# EasyEDA schematic Activation_unfinished_easyeda.json
TITLE: Sheet_1; REV: 1.0; Date: 2021-01-14; Sheet: 1/1; Drawn By: roydouek; Company: Your Company
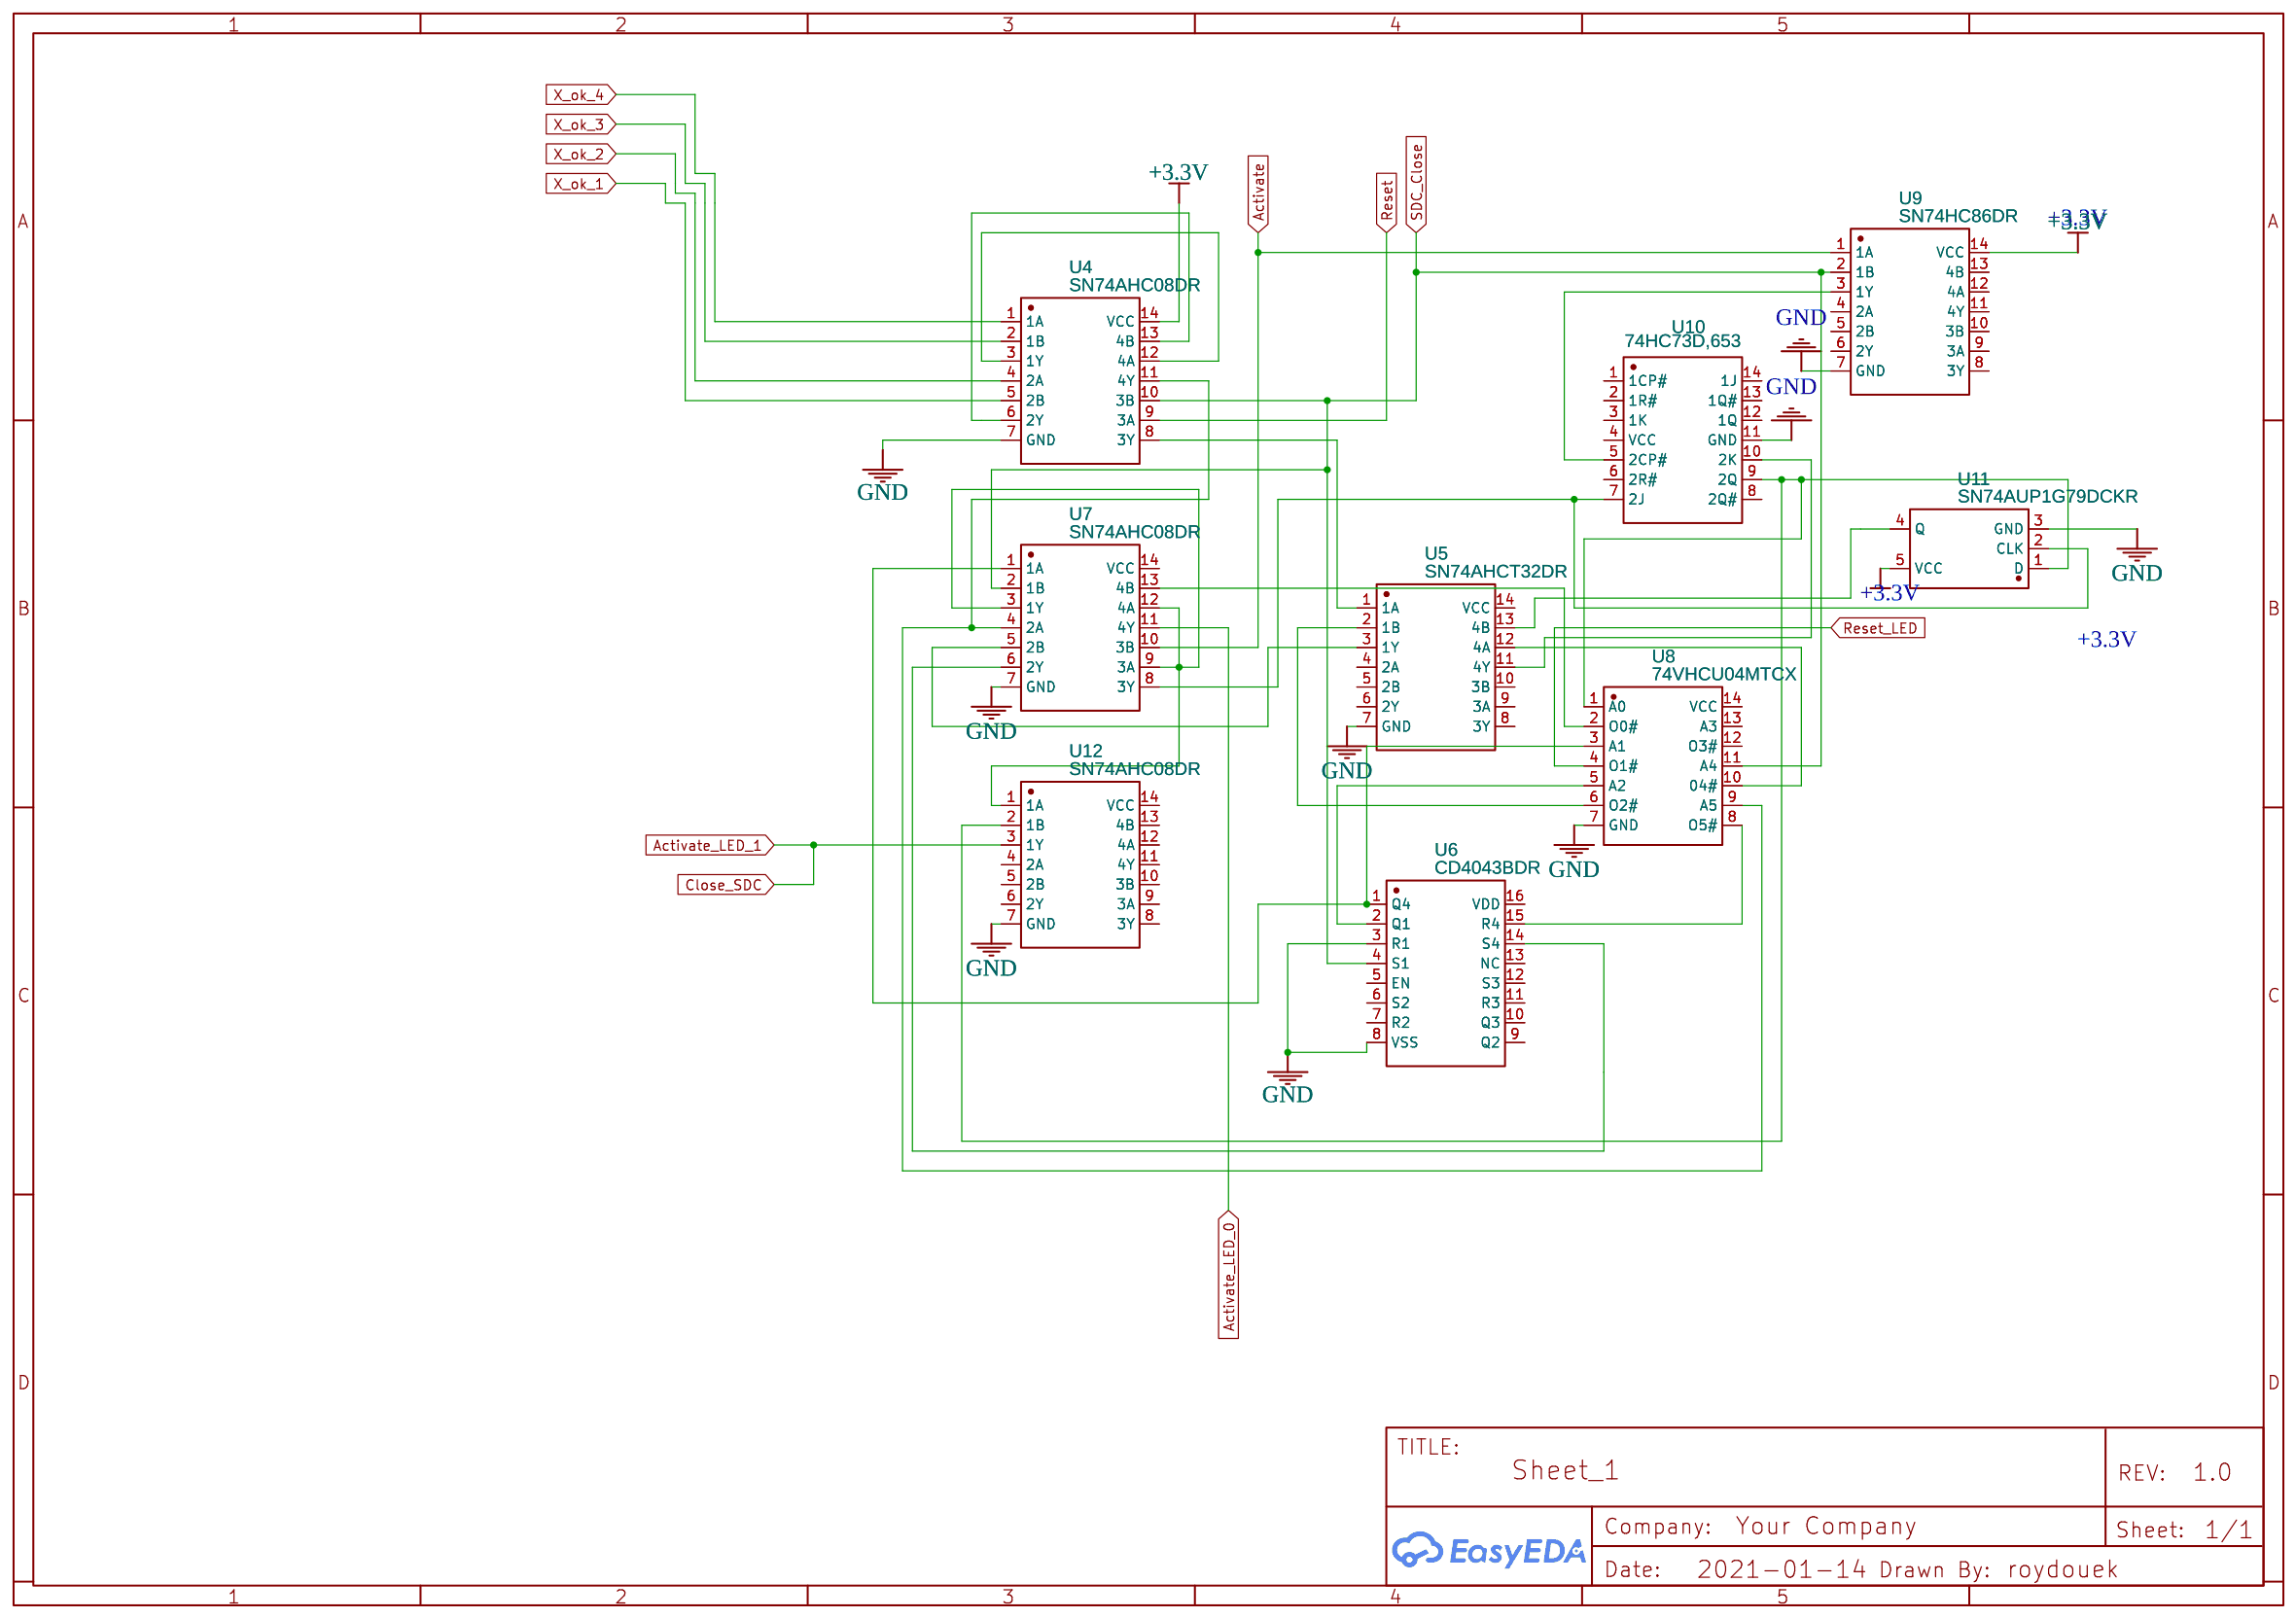
[diagram p0: schematic sheet]

## Parts
U4  SN74AHC08DR  [SOIC-14_L8.7-W3.9-P1.27-LS6.0-BL]
U5  SN74AHCT32DR  [SOIC-14_L8.7-W3.9-P1.27-LS6.0-BL]
U6  CD4043BDR  [SOIC-16_L9.9-W3.9-P1.27-LS6.0-BL]
U7  SN74AHC08DR  [SOIC-14_L8.7-W3.9-P1.27-LS6.0-BL]
U8  74VHCU04MTCX  [TSSOP-14_L5.0-W4.4-P0.65-LS6.4-BL]
U9  SN74HC86DR  [SOIC-14_L8.7-W3.9-P1.27-LS6.0-BL]
U10  74HC73D,653  [SOIC-14_L8.7-W3.9-P1.27-LS6.0-BL]
U11  SN74AUP1G79DCKR  [SC-70-5_L2.1-W1.3-P0.65-LS2.1-BL]
U12  SN74AHC08DR  [SOIC-14_L8.7-W3.9-P1.27-LS6.0-BL]

## Library data of the parts
U4 U7 U12 = SN74AHC08DR: Supplier: LCSC; Manufacturer: TI; image: //image.lceda.cn/szlcsc/C6937.jpg; Supplier Part: C6937; SMT Type: Extend; JLCPCB SMD: Yes; LCSC Assembly: Yes
U5 = SN74AHCT32DR: Supplier: LCSC; Manufacturer: TI; image: //image.lceda.cn/szlcsc/C7490.jpg; Supplier Part: C7490; SMT Type: Extend; JLCPCB SMD: Yes; LCSC Assembly: Yes
U6 = CD4043BDR: Supplier: LCSC; Manufacturer: TI; Supplier Part: C40131; SMT Type: Extend; JLCPCB SMD: Yes; LCSC Assembly: Yes
U8 = 74VHCU04MTCX: Supplier: LCSC; Supplier Part: C238971; Manufacturer: ON Semicon; Contributor: LCSC; SMT Type: Extend; JLCPCB SMD: Yes; LCSC Assembly: Yes
U9 = SN74HC86DR: Supplier: LCSC; Manufacturer: TI; image: //image.lceda.cn/szlcsc/C6763.jpg; Supplier Part: C6763; SMT Type: Extend; JLCPCB SMD: Yes; LCSC Assembly: Yes
U10 = 74HC73D,653: Supplier: LCSC; Manufacturer: Nexperia; Contributor: LCSC; Supplier Part: C148207; SMT Type: Extend; JLCPCB SMD: Yes; LCSC Assembly: Yes
U11 = SN74AUP1G79DCKR: Supplier: LCSC; Supplier Part: C206015; Manufacturer: Texas Instruments; Contributor: LCSC

## Nets
+3.3V: U4.14(VCC) U9.14(VCC) U11.5(VCC)
GND: U4.7(GND) U5.7(GND) U6.3(R1) U6.8(VSS) U7.7(GND) U8.7(GND) U9.7(GND) U10.11(GND) U11.3(GND) U12.7(GND)
Activate: U7.10(3B) U9.1(1A)
Activate_LED_0: U7.11(4Y)
Activate_LED_1: U12.3(1Y)
Reset: U4.9(3A)
Reset_LED: U8.4(O1#)
SDC_Close: U4.10(3B) U6.4(S1) U7.2(1B) U8.11(A4) U9.2(1B)
X_ok_1: U4.5(2B)
X_ok_2: U4.4(2A)
X_ok_3: U4.2(1B)
X_ok_4: U4.1(1A)
Net-(U4-3): U4.3(1Y) U4.12(4A)
Net-(U4-6): U4.6(2Y) U4.13(4B)
Net-(U4-8): U4.8(3Y) U5.1(1A)
Net-(U4-11): U4.11(4Y) U7.4(2A) U8.9(A5)
Net-(U5-2): U5.2(1B) U8.6(O2#)
Net-(U5-3): U5.3(1Y) U7.5(2B)
Net-(U5-11): U5.11(4Y) U10.10(2K)
Net-(U5-12): U5.12(4A) U8.10(04#)
Net-(U5-13): U5.13(4B) U11.4(Q)
Net-(U6-1): U6.1(Q4) U7.1(1A) U8.3(A1)
Net-(U6-2): U6.2(Q1) U8.5(A2)
Net-(U6-14): U6.14(S4) U7.6(2Y)
Net-(U6-15): U6.15(R4) U8.8(O5#)
Net-(U7-3): U7.3(1Y) U7.9(3A) U7.12(4A) U12.1(1A)
Net-(U7-8): U7.8(3Y) U10.7(2J) U11.2(CLK)
Net-(U7-13): U7.13(4B) U8.2(O0#)
Net-(U8-1): U8.1(A0) U10.9(2Q) U11.1(D) U12.2(1B)
Net-(U9-3): U9.3(1Y) U10.5(2CP#)

Not connected (* = marked no-connect by the designer): U5 4(2A) 5(2B) 6(2Y) 8(3Y) 9(3A) 10(3B) 14(VCC); U6 5(EN) 6(S2) 7(R2) 9(Q2) 10(Q3) 11(R3) 12(S3) 13(NC) 16(VDD); U7 14(VCC); U8 12(O3#) 13(A3) 14(VCC); U9 4(2A) 5(2B) 6(2Y) 8(3Y) 9(3A) 10(3B) 11(4Y) 12(4A) 13(4B); U10 1(1CP#) 2(1R#) 3(1K) 4(VCC) 6(2R#) 8(2Q#) 12(1Q) 13(1Q#) 14(1J); U12 4(2A) 5(2B) 6(2Y) 8(3Y) 9(3A) 10(3B) 11(4Y) 12(4A) 13(4B) 14(VCC)

## Notes on the sheet
- +3.3V
- +3.3V
